# EAGLE design interface_th (EAGLE 7.6.0)
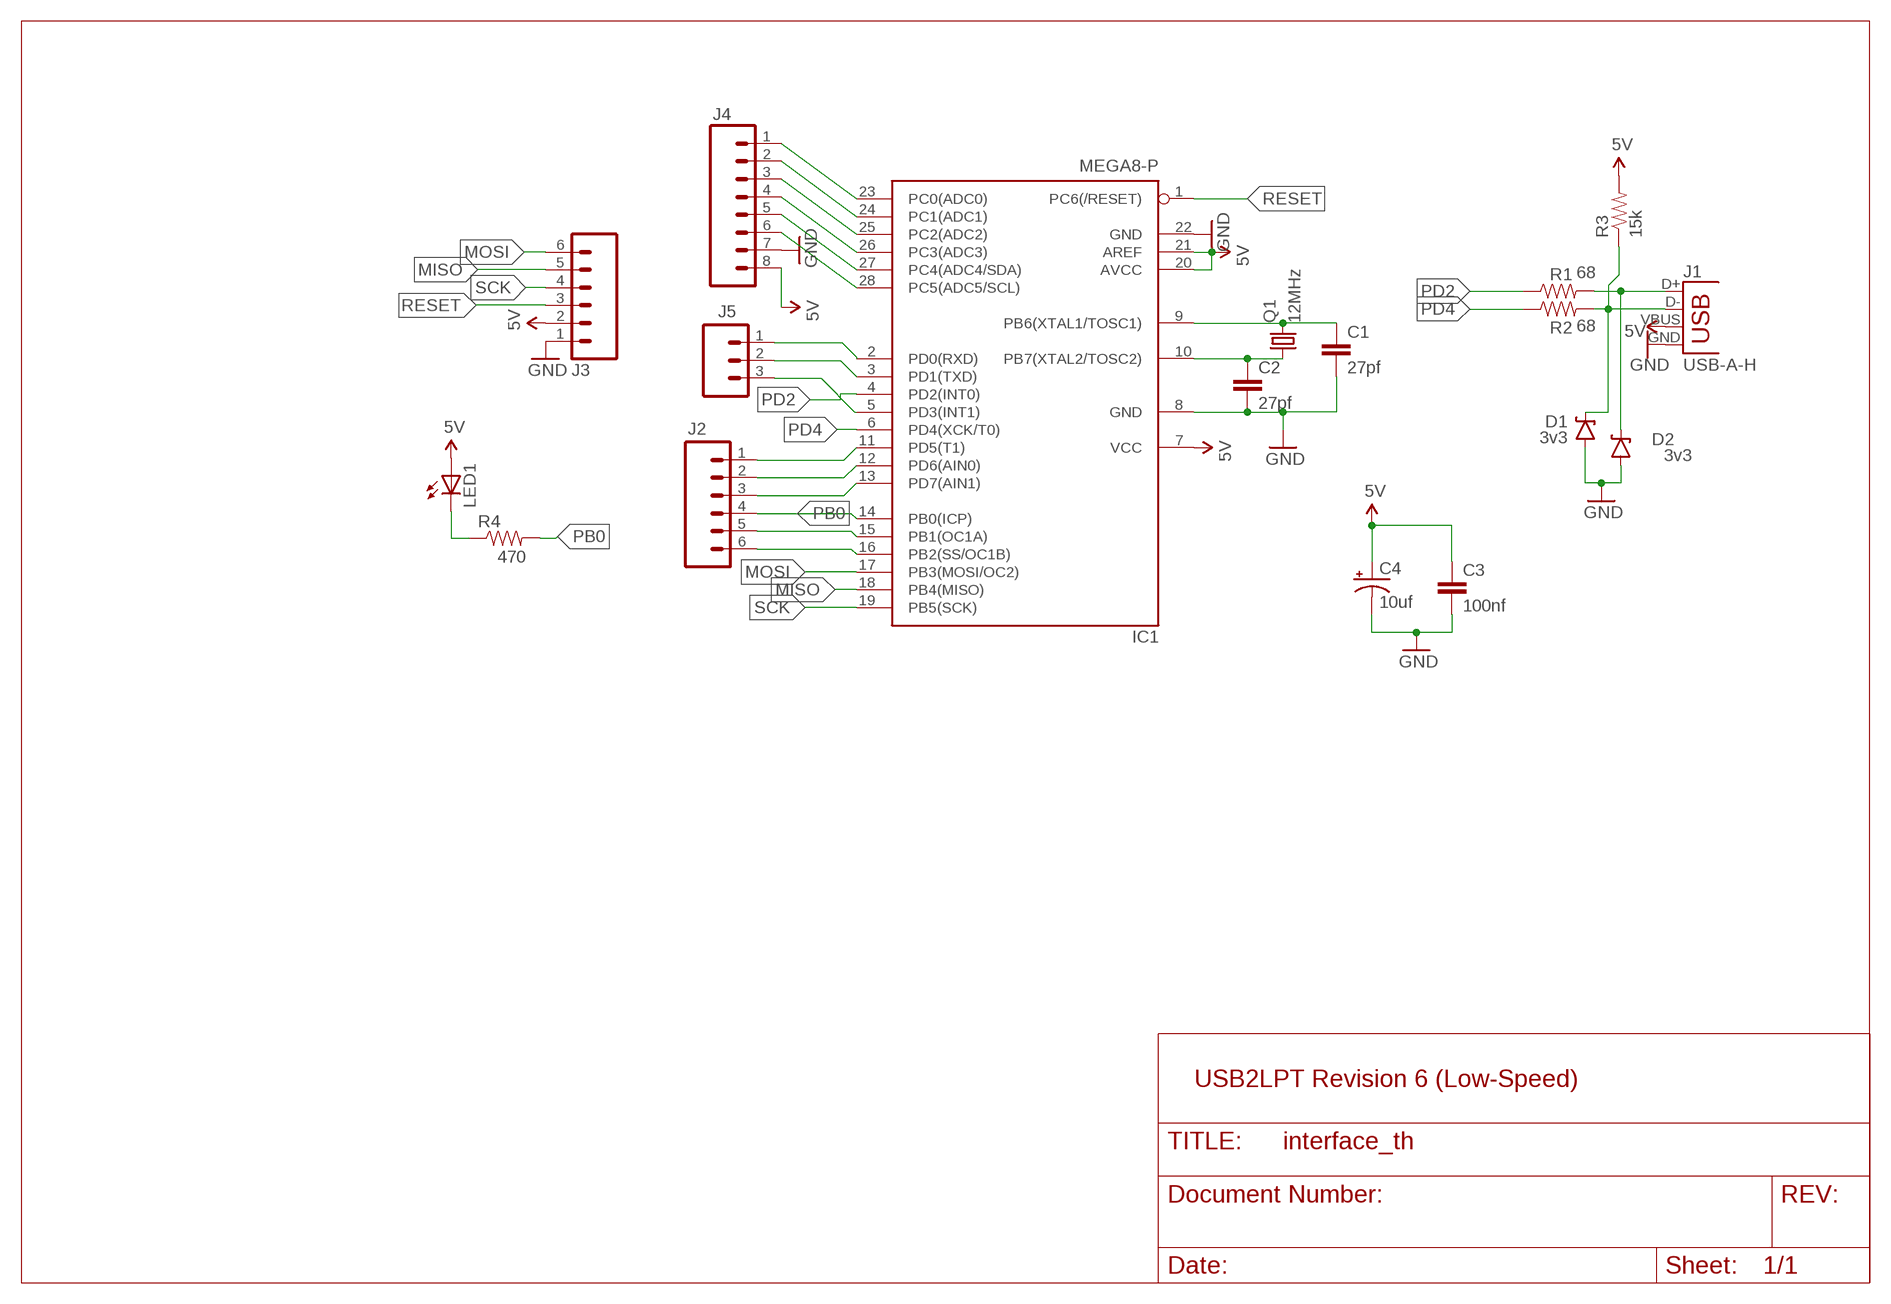
[diagram p0: schematic, sheet 1]

## Parts
C1  27pf  CAPPTH  [CAP-PTH-SMALL]
C2  27pf  CAPPTH  [CAP-PTH-SMALL]
C3  100nf  CAPPTH  [CAP-PTH-SMALL]
C4  10uf  CAP_POLPTH2  [CPOL-RADIAL-10UF-25V]
D1  3v3  DIODE-ZENER  [DIODE-BZT52]
D2  3v3  DIODE-ZENER  [DIODE-BZT52]
IC1  MEGA8-P  [DIL28-3]
J1  USB-A-H  [USB-A-H]
J2  M06LONGPADS  [1X06_LONGPADS]
J3  M06LONGPADS  [1X06_LONGPADS]
J4  M08LONGPADS  [1X08_LONGPADS]
J5  M03LONGPADS  [1X03_LONGPADS]
LED1  LED3MM  [LED3MM]
Q1  12MHz  CRYSTALHC49U-V  [HC49U-V]
R1  68  RESISTORAXIAL-0.3  [AXIAL-0.3]
R2  68  RESISTORAXIAL-0.3  [AXIAL-0.3]
R3  15k  RESISTORAXIAL-0.3  [AXIAL-0.3]
R4  470  RESISTORAXIAL-0.3  [AXIAL-0.3]

## Nets
5V: C3.1 C4.1(+) IC1.7(VCC) IC1.20(AVCC) IC1.21(AREF) J1.VBUS J3.2 J4.8 LED1.A R3.P$2
GND: C1.2 C2.2 C3.2 C4.2(-) D1.A D2.A IC1.8(GND) IC1.22(GND) J1.GND J3.1 J4.7
MISO: IC1.18(PB4(MISO)) J3.5
MOSI: IC1.17(PB3(MOSI/OC2)) J3.6
N$1: LED1.K(C) R4.P$1
N$2: IC1.11(PD5(T1)) J2.1
N$3: IC1.23(PC0(ADC0)) J4.1
N$4: C2.1 IC1.10(PB7(XTAL2/TOSC2)) Q1.1
N$5: C1.1 IC1.9(PB6(XTAL1/TOSC1)) Q1.2
N$6: D1.C J1.D- R2.P$2 R3.P$1
N$7: D2.C J1.D+ R1.P$2
N$8: IC1.24(PC1(ADC1)) J4.2
N$9: IC1.25(PC2(ADC2)) J4.3
N$10: IC1.26(PC3(ADC3)) J4.4
N$11: IC1.27(PC4(ADC4/SDA)) J4.5
N$12: IC1.28(PC5(ADC5/SCL)) J4.6
N$13: IC1.12(PD6(AIN0)) J2.2
N$14: IC1.13(PD7(AIN1)) J2.3
N$16: IC1.15(PB1(OC1A)) J2.5
N$17: IC1.16(PB2(SS/OC1B)) J2.6
N$18: IC1.2(PD0(RXD)) J5.1
N$19: IC1.3(PD1(TXD)) J5.2
N$20: IC1.5(PD3(INT1)) J5.3
PB0: IC1.14(PB0(ICP)) J2.4 R4.P$2
PD2: IC1.4(PD2(INT0)) R1.P$1
PD4: IC1.6(PD4(XCK/T0)) R2.P$1
RESET: IC1.1(PC6(/RESET)) J3.3
SCK: IC1.19(PB5(SCK)) J3.4

## Notes on the sheet
- USB2LPT Revision 6 (Low-Speed)

## Library data of the parts
C1 C2 = SparkFun-Passives:CAP: Capacitor Standard 0603 ceramic capacitor, and 0.1" leaded capacitor.
C3 = SparkFun-Capacitors:CAP: Capacitor Standard 0603 ceramic capacitor, and 0.1" leaded capacitor.
C4 = SparkFun-Passives:CAP_POL: Capacitor Polarized These are standard SMD and PTH capacitors. Normally 10uF, 47uF, and 100uF in electrolytic and tantalum varieties. Always verify the external diameter of the through hole cap, it varies with capacity, voltage, and manufacturer. The EIA devices should be standard.
D1 D2 = SparkFun-DiscreteSemi:DIODE-ZENER: Zener Diode Production Part - 8199 3.4V Zener Voltage; PROD-ID: DIO-08199; VALUE: BZT52
IC1 = atmel:MEGA8-P: MICROCONTROLLER 8 Kbytes FLASH, 1 kbytes SRAM, 512 bytes EEPROM, USART, 4-channel 10 bit ADC, 2-channel 8 bit ADC Pin compatible with Atmega48, ATMega88, ATMega168 Source: avr.lbr; OC_FARNELL: unknown; OC_NEWARK: unknown
J1 = SparkFun-Connectors:USB: USB Connectors USB-B-PTH is fully proven SKU : PRT-00139/CONN-08278 USB-miniB is fully proven SKU : PRT-00587 USB-A-PCB is untested. USB-A-H is throughly reviewed, but untested. Spark Fun Electronics SKU : PRT-00437 USB-B-SMT is throughly reviewed, but untested. Needs silkscreen touching up. USB-A-S has not been used/tested USB-MB-H has not been used/tested USB-MICROB has been used. CONN-09505; PROD_ID: CONN-08367
J2 J3 = SparkFun-Connectors:M06: Header 6 Standard 6-pin 0.1" header. Use with straight break away headers (SKU : PRT-00116), right angle break away headers (PRT-00553), swiss pins (PRT-00743), machine pins (PRT-00117), and female headers (PRT-00115). Molex polarized connector foot print use with SKU : PRT-08094 with associated crimp pins and housings. NOTES ON THE VARIANTS LOCK and LOCK_LONGPADS... This footprint was designed to help hold the alignment of a through-hole component (i.e. 6-pin header) while soldering it into place. You may notice that each hole has been shifted either up or down by 0.005 of an inch from it's more standard position (which is a perfectly straight line). This slight alteration caused the pins (the squares in the middle) to touch the edges of the holes. Because they are alternating, it causes a "brace" to hold the component in place. 0.005 has proven to be the perfect amount of "off-center" position when using our standard breakaway headers. Although looks a little odd when you look at the bare footprint, once you have a header in there, the alteration is very hard to notice. Also,if you push a header all the way into place, it is covered up entirely on the bottom side. This idea of altering the position of holes to aid alignment will be further integrated into the Sparkfun Library for other footprints. It can help hold any component with 3 or more connection pins.
J4 = SparkFun-Connectors:M08: Header 8 Standard 8-pin 0.1" header. Use with straight break away headers (SKU : PRT-00116), right angle break away headers (PRT-00553), swiss pins (PRT-00743), machine pins (PRT-00117), and female headers (PRT-00115).
J5 = SparkFun-Connectors:M03: Header 3 Standard 3-pin 0.1" header. Use with straight break away headers (SKU : PRT-00116), right angle break away headers (PRT-00553), swiss pins (PRT-00743), machine pins (PRT-00117), and female headers (PRT-00115). Molex polarized connector foot print use with SKU : PRT-08232 with associated crimp pins and housings.
LED1 = adafruit:LED: LED OSRAM: - CHIPLED LG R971, LG N971, LY N971, LG Q971, LY Q971, LO R971, LY R971 LH N974, LH R974 LS Q976, LO Q976, LY Q976 LO Q996 - Hyper CHIPLED LW Q18S LB Q993, LB Q99A, LB R99A - SideLED LS A670, LO A670, LY A670, LG A670, LP A670 LB A673, LV A673, LT A673, LW A673 LH A674 LY A675 LS A676, LA A676, LO A676, LY A676, LW A676 LS A679, LY A679, LG A679 - Hyper Micro SIDELED® LS Y876, LA Y876, LO Y876, LY Y876 LT Y87S - SmartLED LW L88C, LW L88S LB L89C, LB L89S, LG L890 LS L89K, LO L89K, LY L89K LS L896, LA L896, LO L896, LY L896 - TOPLED LS T670, LO T670, LY T670, LG T670, LP T670 LSG T670, LSP T670, LSY T670, LOP T670, LYG T670 LG T671, LOG T671, LSG T671 LB T673, LV T673, LT T673, LW T673 LH T674 LS T676, LA T676, LO T676, LY T676, LB T676, LH T676, LSB T676, LW T676 LB T67C, LV T67C, LT T67C, LS T67K, LO T67K, LY T67K, LW E67C LS E67B, LA E67B, LO E67B, LY E67B, LB E67C, LV E67C, LT E67C LW T67C LS T679, LY T679, LG T679 LS T770, LO T770, LY T770, LG T770, LP T770 LB T773, LV T773, LT T773, LW T773 LH T774 LS E675, LA E675, LY E675, LS T675 LS T776, LA T776, LO T776, LY T776, LB T776 LHGB T686 LT T68C, LB T68C - Hyper Mini TOPLED® LB M676 - Mini TOPLED Santana® LG M470 LS M47K, LO M47K, LY M47K Source: http://www.osram.convergy.de/
Q1 = crystal:CRYSTAL: CRYSTAL; OC_FARNELL: 1666969; OC_NEWARK: unknown
R1-R4 = SparkFun-Passives:RESISTOR: Resistor Basic schematic elements and footprints for 0603, 1206, and PTH resistors.

## Board
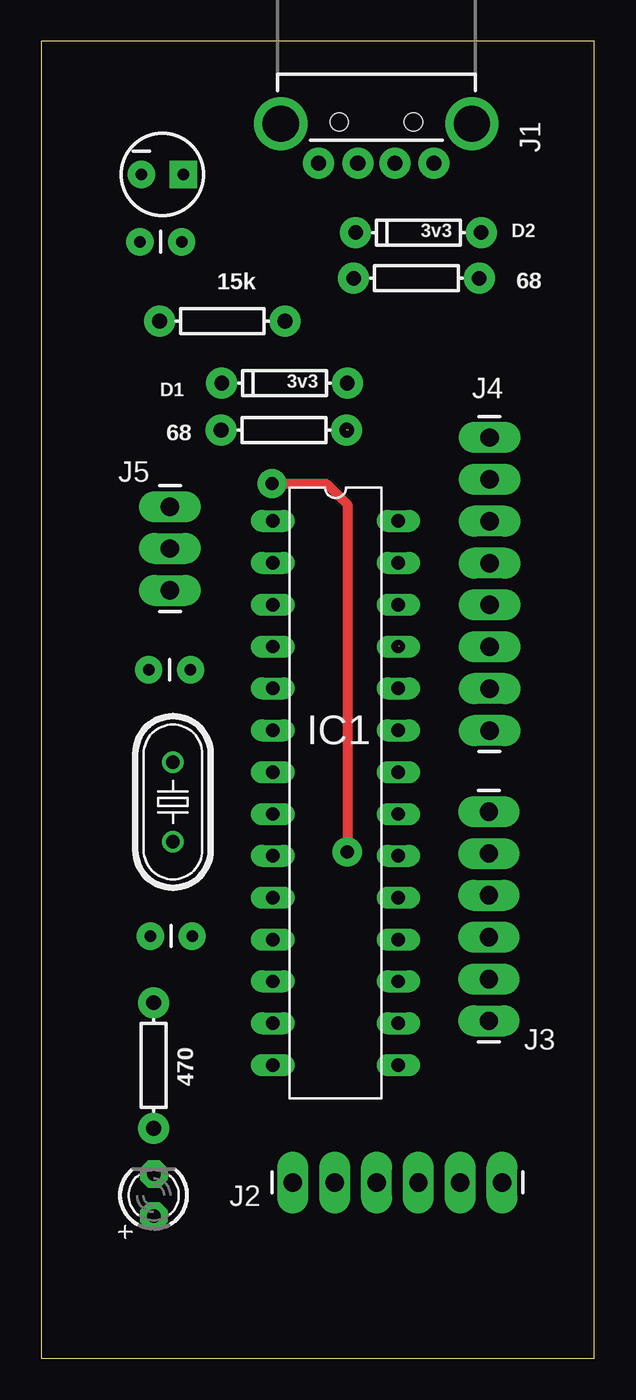
[diagram p1: board, top side]
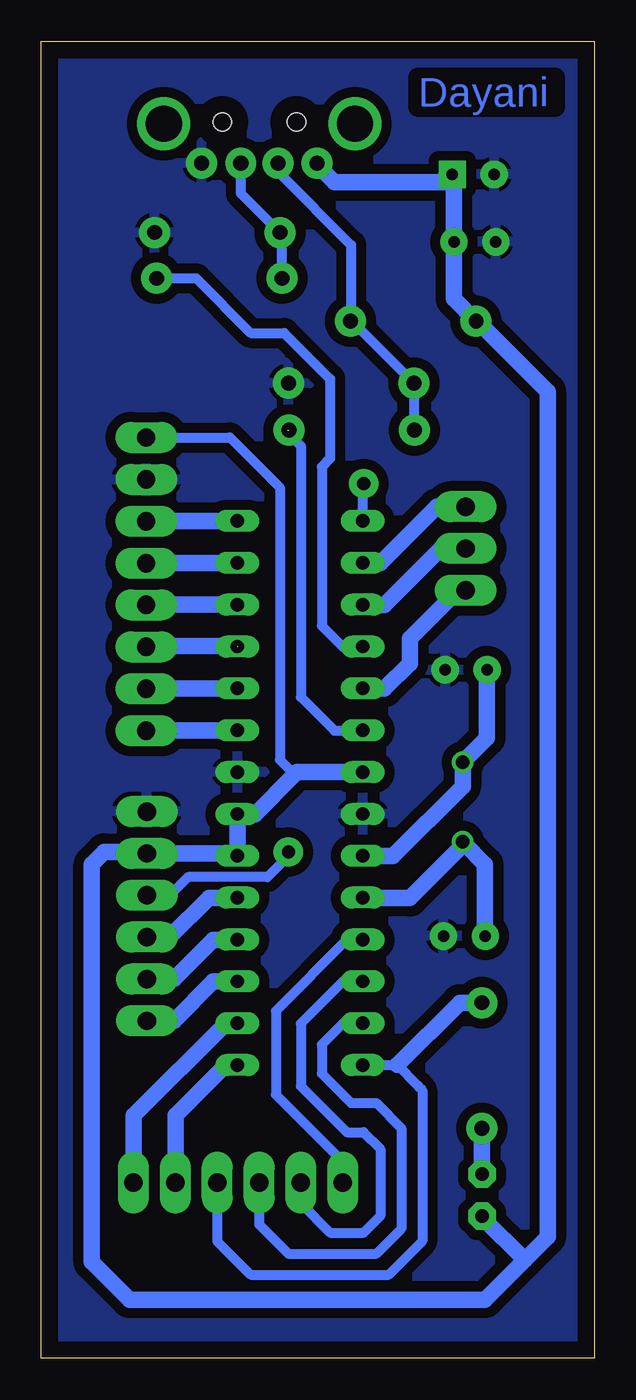
[diagram p2: board, bottom side, seen from below]

Size 33.6 x 79.94 mm. Coordinates in mm from the lower left corner, seen from the top.
Outline: 0,0 33.6,0 33.6,79.94 0,79.94 0,0
Copper layers (1*16): Top 0.035mm / dielectric 1.5mm / Bottom 0.035mm
Design rules "default *": minimum track width 24mil, minimum drill 24mil, track to track 16mil, track to pad 16mil, pad to pad 8mil, via to via 16mil, smd to smd 8mil, copper to edge 40mil, drill to drill 16mil, minimum pad ring 10mil, minimum via ring 8mil, stop-mask expansion 4mil, vias tented up to drill 0mil, thermal gap 10mil

### Footprints (pad centres in the part's own frame; a part is rotated, then mirrored left to right if it is on the bottom)
CAP-PTH-SMALL = drill 0.7 pad 1.651: 1 0,0; 2 2.54,0
CPOL-RADIAL-10UF-25V = drill 0.7 pad 1.651 square: 1 1.27,0 | drill 0.7 pad 1.651: 2 -1.27,0
DIODE-BZT52 = drill 0.9 pad 1.88: A -3.81,0; C 3.81,0
DIL28-3 = drill 0.813 long: 1 -16.51,-3.81; 2 -13.97,-3.81; 3 -11.43,-3.81; 4 -8.89,-3.81; 5 -6.35,-3.81; 6 -3.81,-3.81; 7 -1.27,-3.81; 8 1.27,-3.81; 9 3.81,-3.81; 10 6.35,-3.81; 11 8.89,-3.81; 12 11.43,-3.81; 13 13.97,-3.81; 14 16.51,-3.81; 15 16.51,3.81; 16 13.97,3.81; 17 11.43,3.81; 18 8.89,3.81; 19 6.35,3.81; 20 3.81,3.81; 21 1.27,3.81; 22 -1.27,3.81; 23 -3.81,3.81; 24 -6.35,3.81; 25 -8.89,3.81; 26 -11.43,3.81; 27 -13.97,3.81; 28 -16.51,3.81
USB-A-H = drill 0.914 pad 1.88: D+ 2.4,1.127; D- 2.4,-1.127; GND 2.4,3.5; VBUS 2.4,-3.5 | drill 2.2: GND2 0,-5.8; GND3 0,5.8 | hole 1.1: -0.1,2.25; -0.1,-2.25
1X06_LONGPADS = drill 1.118 pad 1.88 long: 1 0,0; 2 2.54,0; 3 5.08,0; 4 7.62,0; 5 10.16,0; 6 12.7,0
1X08_LONGPADS = drill 1.118 pad 1.88 long: 1 0,0; 2 2.54,0; 3 5.08,0; 4 7.62,0; 5 10.16,0; 6 12.7,0; 7 15.24,0; 8 17.78,0
1X03_LONGPADS = drill 1.118 pad 1.88 long: 1 0,0; 2 2.54,0; 3 5.08,0
LED3MM = drill 0.813 pad 1.676 octagon: A -1.27,0; K 1.27,0
HC49U-V = drill 0.813: 1 -2.413,0; 2 2.413,0
AXIAL-0.3 = drill 0.9 pad 1.88: P$1 -3.81,0; P$2 3.81,0

### Placement (x,y rotation side)
C1  6.53,41.79 0 top
C2  6.63,25.62 0 top
C3  8.53,67.76 180 top
C4  7.36,71.85 0 top
D1  14.78,59.18 180 top
D2  22.9,68.33 180 top
IC1  17.88,34.31 270 top
J1  20.35,74.93 270 top
J2  15.28,10.67 0 top
J3  27.18,33.18 270 top
J4  27.22,38.1 90 top
J5  7.82,51.69 270 top
LED1  6.83,9.9 90 top
Q1  8,33.77 90 top
R1  22.78,65.54 180 top
R2  14.74,56.32 180 top
R3  11,62.96 180 top
R4  6.83,17.77 90 top

### Tracks (layer width: path | path; a pad name or v marks a point on that pad's centre or on a via)
5V
  Bottom 0.61: J4.8 22.14,55.88 19.09,52.83 19.09,36.32 18.21,35.43
  Bottom 1.016: J1.VBUS 16.85,72.43 15.79,71.37 9.11,71.37 C4.1 8.53,71.76 C3.1 8.53,64.3 R3.P$2 7.12,62.96 2.84,58.67 2.84,7.37 4.23,5.97 | 4.23,5.97 6.65,3.56 28.24,3.56 30.52,5.84 30.52,29.97 29.76,30.73 27.28,30.73 J3.2 21.83,30.64 IC1.20 IC1.21 21.67,33.02 20.62,33.02 18.21,35.43 18.06,35.58 IC1.7 | LED1.A 6.83,8.57 4.23,5.97
GND
  pour Bottom (isolate 0.61): 0.55,78.99 33.32,78.99 33.32,0.76 0.55,0.76
MISO
  Bottom 1.016: J3.5 25.54,23.02 23.16,25.4 21.7,25.4 IC1.18
MOSI
  Bottom 1.016: J3.6 25.54,20.48 23.16,22.86 21.7,22.86 IC1.17
N$1
  Bottom 1.016: R4.P$1 LED1.K
N$2
  Bottom 0.61: IC1.11 15.01,25.42 19.35,21.08 19.35,16 15.28,11.94 J2.1
N$3
  Bottom 1.016: IC1.23 27.21,38.12 J4.1
N$4
  Bottom 1.016: Q1.1 8,31.33 | 8,31.33 6.65,29.97 6.65,25.64 C2.1 | 8,31.33 8,31.16 11.22,27.94 14.05,27.94 IC1.10
N$5
  Bottom 1.016: C1.1 6.53,37.66 Q1.2 8,34.71 12.24,30.48 14.05,30.48 IC1.9
N$6
  Bottom 0.61: J1.D- 19.22,72.01 14.78,67.56 14.78,62.99 R3.P$1 14.74,62.96 D1.C 10.97,56.36 R2.P$2
N$7
  Bottom 0.61: J1.D+ 21.48,70.71 D2.C 18.97,68.21 R1.P$2
N$8
  Bottom 1.016: IC1.24 27.21,40.66 J4.2
N$9  (1 unrouted)
  Bottom 1.016: 21.71,43.22 27.18,43.22 J4.3
N$10
  Bottom 1.016: IC1.26 27.21,45.74 J4.4
N$11
  Bottom 1.016: IC1.27 27.21,48.28 J4.5
N$12
  Bottom 1.016: IC1.28 27.21,50.82 J4.6
N$13
  Bottom 0.61: IC1.12 14.08,22.86 15.28,22.86 17.82,20.32 17.82,16.51 15.03,13.72 14.01,13.72 13,12.7 13,8.64 14.01,7.62 16.05,7.62 17.82,9.4 J2.2
N$14
  Bottom 0.61: IC1.13 14.08,20.32 15.28,20.32 16.55,19.05 16.55,17.27 14.78,15.49 13.25,15.49 11.73,13.97 11.73,7.87 13.25,6.35 18.59,6.35 20.36,8.13 J2.3
N$16
  Bottom 1.016: IC1.15 22.38,17.8 25.44,14.73 J2.5
N$17
  Bottom 1.016: IC1.16 22.38,20.34 27.98,14.73 J2.6
N$18
  Bottom 1.016: J5.1 9.57,51.69 13,48.26 14.05,48.26 IC1.2
N$19
  Bottom 1.016: J5.2 9.32,49.15 12.74,45.72 14.05,45.72 IC1.3
N$20
  Bottom 1.016: J5.3 8.3,46.61 11.22,43.69 11.22,42.16 12.74,40.64 14.05,40.64 IC1.5
PB0
  Bottom 0.61: IC1.14 11.97,17.8 10.71,16.54 10.71,16.51 10.46,16.26 10.46,7.11 12.49,5.08 20.87,5.08 22.9,7.11 J2.4
  Bottom 1.016: R4.P$2 8.18,21.58 11.97,17.8
PD2
  Bottom 0.61: R1.P$1 24.19,65.54 20.87,62.23 18.84,62.23 16.05,59.44 16.05,54.61 16.55,54.1 16.55,44.45 15.28,43.18 14.08,43.18 IC1.4
PD4  (1 unrouted)
  Bottom 0.61: 18.65,56.32 18.65,56.2 17.82,55.37 17.82,40.13 15.79,38.1 14.08,38.1 IC1.6
RESET  (via drill 0.8 pad 1.78)
  Top 0.61: v14.01,53.09 17.32,53.09 18.59,51.82 v18.59,30.73
  Bottom 0.61: IC1.1 14.07,53.03 v14.01,53.09 | v18.59,30.73 18.59,30.48 19.86,29.21 24.68,29.21 25.95,27.94 27.02,27.94 J3.3
SCK
  Bottom 1.016: J3.4 25.79,25.56 23.41,27.94 21.7,27.94 IC1.19

### Text on the board
Bottom: Dayani